# EAGLE schematic motherboard (EAGLE 5.10)
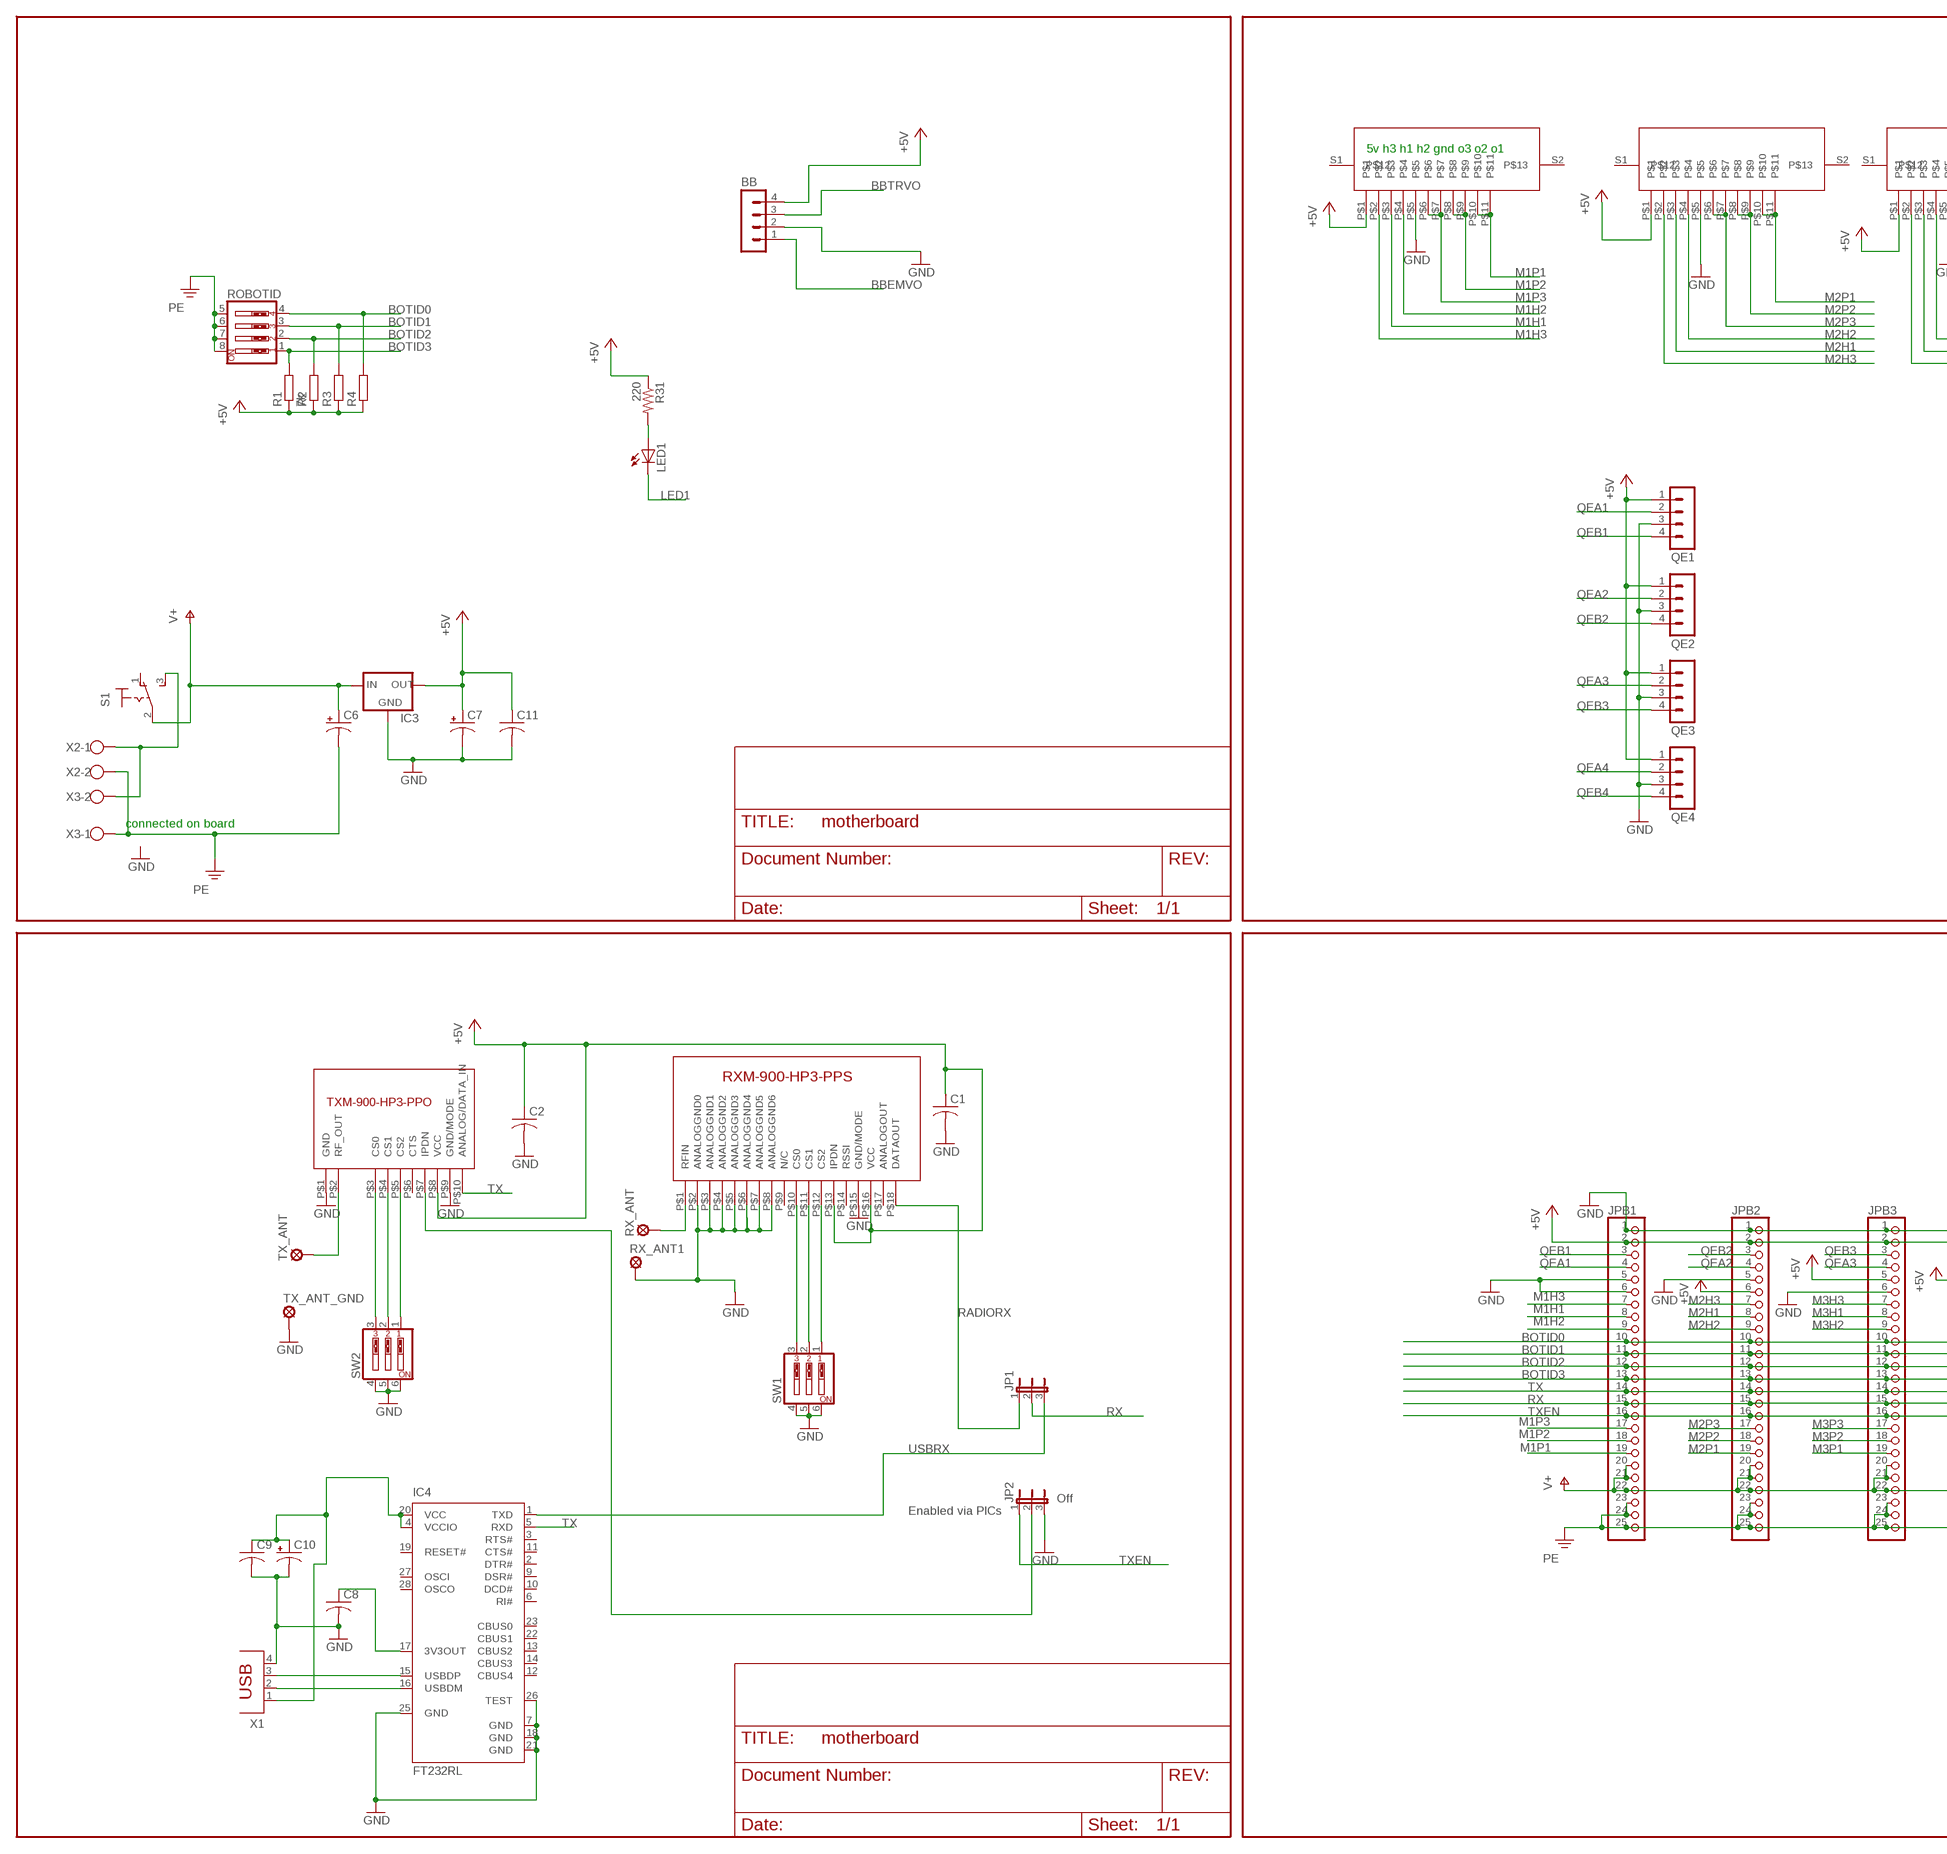
[diagram p0: schematic, sheet 1, part 1 of 2]
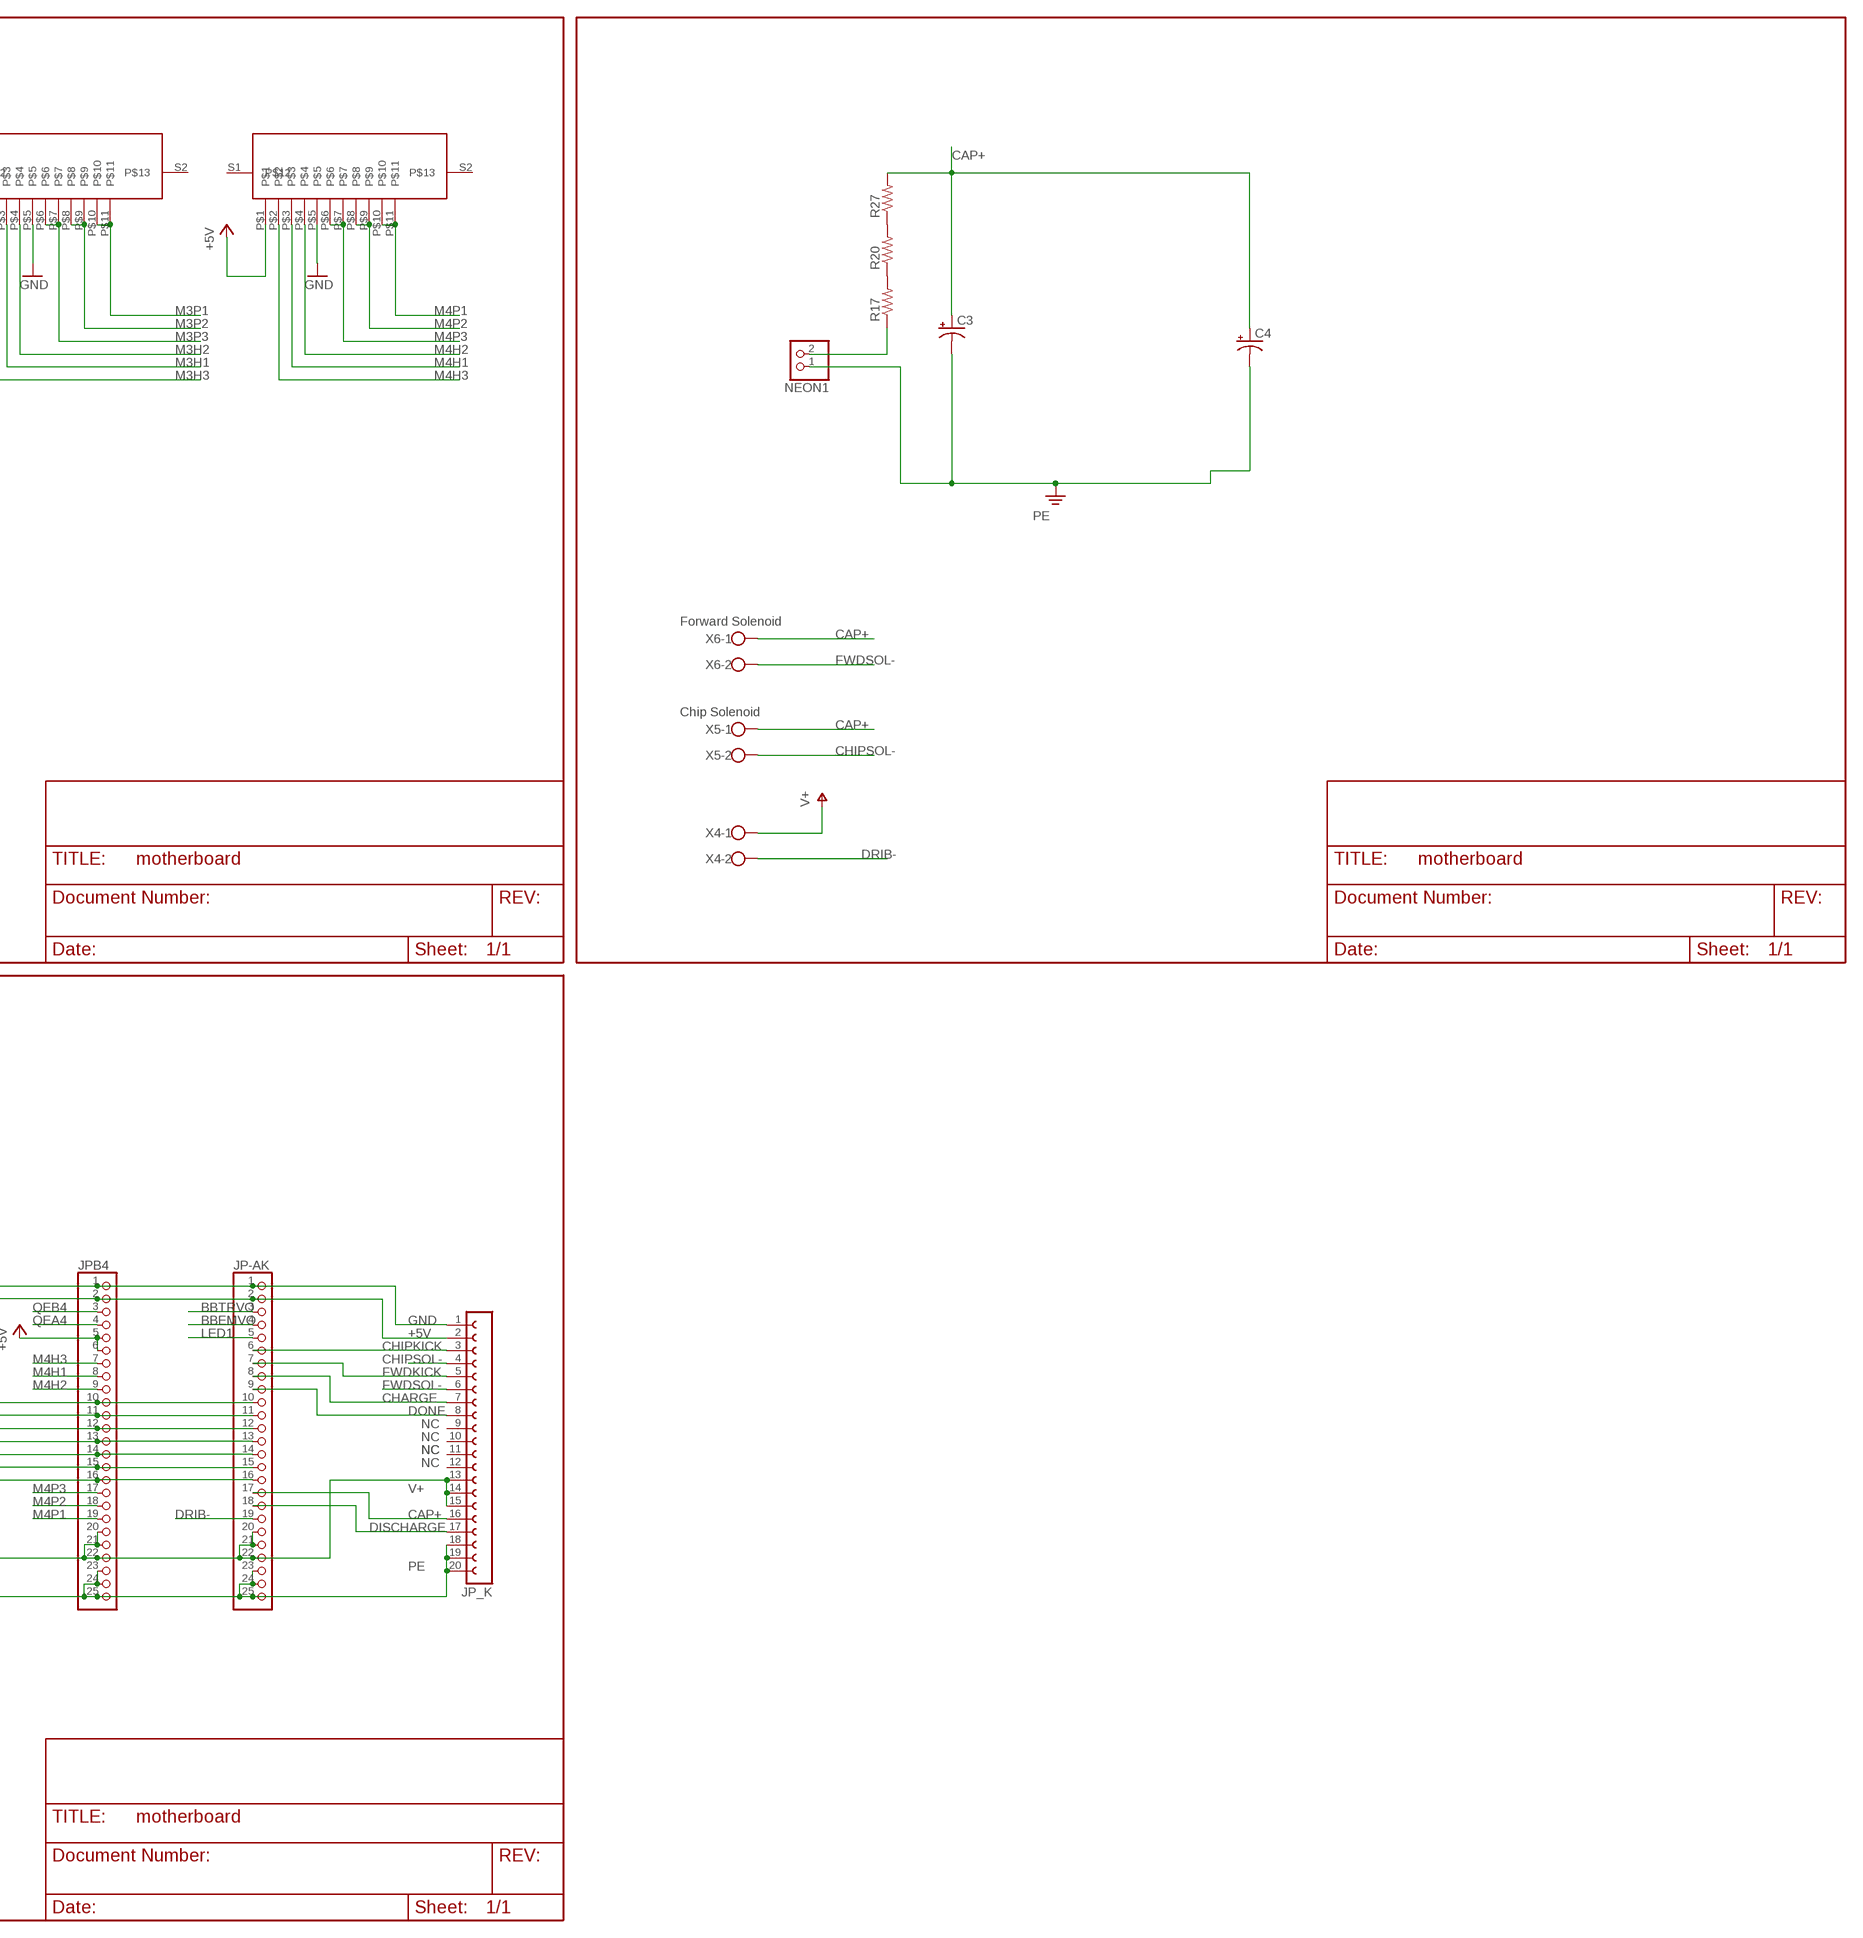
[diagram p1: schematic, sheet 1, part 2 of 2]

## Parts
BB  MA04-1  [MA04-1]
C1  C-USC0805  [C0805]
C2  C-USC0805  [C0805]
C3  CPOL-USE10-35  [EB35D]
C4  CPOL-USE10-35  [EB35D]
C6  CPOL-USE3.5-8  [E3,5-8]
C7  CPOL-USE3.5-8  [E3,5-8]
C8  C-USC0805  [C0805]
C9  C-USC0805  [C0805]
C10  CPOL-USE2.5-6  [E2,5-6]
C11  C-USC0805  [C0805]
IC3  78XXS  [78XXS]
IC4  FT232RL  [SSOP28]
JP1  JP2E  [JP2]
JP2  JP2E  [JP2]
JP-AK  PINHD-1X25  [1X25]
JP_K  FE20-1  [FE20]
JPB1  PINHD-1X25  [1X25]
JPB2  PINHD-1X25  [1X25]
JPB3  PINHD-1X25  [1X25]
JPB4  PINHD-1X25  [1X25]
LED1  LEDCHIPLED_0805  [CHIPLED_0805]
MOTOR1  MOTORCONNECT  [53261-11]
MOTOR2  MOTORCONNECT  [53261-11]
MOTOR3  MOTORCONNECT  [53261-11]
MOTOR4  MOTORCONNECT  [53261-11]
NEON1  PINHD-1X2  [1X02]
QE1  MA04-1  [MA04-1]
QE2  MA04-1  [MA04-1]
QE3  MA04-1  [MA04-1]
QE4  MA04-1  [MA04-1]
R1  7k  R-R0805  [R0805]
R2  R-R0805  [R0805]
R3  R-R0805  [R0805]
R4  R-R0805  [R0805]
R17  R-US_R0805  [R0805]
R20  R-US_R0805  [R0805]
R27  R-US_R0805  [R0805]
R31  220  R-US_R0805  [R0805]
ROBOTID  SW_DIP-4  [EDG-04]
RX_ANT  LSP13  [LSP13]
RX_ANT1  LSP13  [LSP13]
S1  M9040P  [M9040P]
SW1  SW_DIP-3  [EDG-03]
SW2  SW_DIP-3  [EDG-03]
TX_ANT  LSP13  [LSP13]
TX_ANT_GND  LSP13  [LSP13]
U$1  RXM-900-HP3-PPS  [SIP-18]
U$2  TXM-900-HP3-PPO  [SIP-10]
X1  PN61729  [PN61729]
X2  W237-102  [W237-102]
X3  W237-102  [W237-102]
X4  W237-102  [W237-102]
X5  W237-102  [W237-102]
X6  W237-102  [W237-102]

## Nets
+5V: BB.4 C1.1 C2.1 C7.+ C11.1 IC3.OUT JP-AK.2 JP_K.2 JPB1.2 JPB2.2 JPB2.6 JPB3.2 JPB3.5 JPB4.2 JPB4.5 JPB4.6 MOTOR1.P$1 MOTOR2.P$1 MOTOR3.P$1 MOTOR4.P$1 QE1.1 QE2.1 QE3.1 QE4.1 R1.1 R2.1 R3.1 R4.1 R31.1 U$1.P$13(IPDN) U$1.P$16(VCC) U$2.P$8(VCC)
BATT2+: S1.3(S) X2.1 X3.2
BBEMVO: BB.1 JP-AK.4
BBTRVO: BB.3 JP-AK.3
BOTID0: JP-AK.10 JPB1.10 JPB2.10 JPB3.10 JPB4.10 R4.2 ROBOTID.4
BOTID1: JP-AK.11 JPB1.11 JPB2.11 JPB3.11 JPB4.11 R3.2 ROBOTID.3
BOTID2: JP-AK.12 JPB1.12 JPB2.12 JPB3.12 JPB4.12 R2.2 ROBOTID.2
BOTID3: JP-AK.13 JPB1.13 JPB2.13 JPB3.13 JPB4.13 R1.2 ROBOTID.1
CAP+: C3.+ C4.+ JP-AK.17 JP_K.16 R27.2 X5.1 X6.1
CHARGE: JP-AK.8 JP_K.7
CHIPKICK: JP-AK.6 JP_K.3
CHIPSOL-: JP_K.4 X5.2
DISCHARGE: JP-AK.18 JP_K.17
DONE: JP-AK.9 JP_K.8
DRIB-: JP-AK.19 X4.2
FWDKICK: JP-AK.7 JP_K.5
FWDSOL-: JP_K.6 X6.2
GND: BB.2 C1.2 C2.2 C7.- C8.2 C9.2 C10.- C11.2 IC3.GND IC4.7(GND) IC4.18(GND) IC4.21(GND) IC4.25(GND) IC4.26(TEST) JP2.3 JP-AK.1 JP_K.1 JPB1.1 JPB1.5 JPB1.6 JPB2.1 JPB2.5 JPB3.1 JPB3.6 JPB4.1 MOTOR1.P$5 MOTOR2.P$5 MOTOR3.P$5 MOTOR4.P$5 QE1.3 QE2.3 QE3.3 QE4.3 RX_ANT1.MP SW1.4 SW1.5 SW1.6 SW2.4 SW2.5 SW2.6 TX_ANT_GND.MP U$1.P$2(ANALOGGND0) U$1.P$3(ANALOGGND1) U$1.P$4(ANALOGGND2) U$1.P$5(ANALOGGND3) U$1.P$6(ANALOGGND4) U$1.P$7(ANALOGGND5) U$1.P$8(ANALOGGND6) U$1.P$15(GND/MODE) U$2.P$1(GND) U$2.P$9(GND/MODE) X1.4
LED1: JP-AK.5 LED1.C
M1H1: JPB1.8 MOTOR1.P$3
M1H2: JPB1.9 MOTOR1.P$4
M1H3: JPB1.7 MOTOR1.P$2
M1P1: JPB1.19 MOTOR1.P$10 MOTOR1.P$11
M1P2: JPB1.18 MOTOR1.P$8 MOTOR1.P$9
M1P3: JPB1.17 MOTOR1.P$6 MOTOR1.P$7
M2H1: JPB2.8 MOTOR2.P$3
M2H2: JPB2.9 MOTOR2.P$4
M2H3: JPB2.7 MOTOR2.P$2
M2P1: JPB2.19 MOTOR2.P$10 MOTOR2.P$11
M2P2: JPB2.18 MOTOR2.P$8 MOTOR2.P$9
M2P3: JPB2.17 MOTOR2.P$6 MOTOR2.P$7
M3H1: JPB3.8 MOTOR3.P$3
M3H2: JPB3.9 MOTOR3.P$4
M3H3: JPB3.7 MOTOR3.P$2
M3P1: JPB3.19 MOTOR3.P$10 MOTOR3.P$11
M3P2: JPB3.18 MOTOR3.P$8 MOTOR3.P$9
M3P3: JPB3.17 MOTOR3.P$6 MOTOR3.P$7
M4H1: JPB4.8 MOTOR4.P$3
M4H2: JPB4.9 MOTOR4.P$4
M4H3: JPB4.7 MOTOR4.P$2
M4P1: JPB4.19 MOTOR4.P$10 MOTOR4.P$11
M4P2: JPB4.18 MOTOR4.P$8 MOTOR4.P$9
M4P3: JPB4.17 MOTOR4.P$6 MOTOR4.P$7
N$2: C9.1 C10.+ IC4.4(VCCIO) IC4.20(VCC) X1.1
N$3: LED1.A R31.2
N$13: RX_ANT.MP U$1.P$1(RFIN)
N$14: TX_ANT.MP U$2.P$2(RF_OUT)
N$16: JP2.2 U$2.P$7(IPDN)
N$17: C8.1 IC4.17(3V3OUT)
N$18: IC4.15(USBDP) X1.3
N$19: IC4.16(USBDM) X1.2
N$21: R17.2 R20.1
N$27: R20.2 R27.1
N$31: NEON1.2 R17.1
PE: C3.- C4.- C6.- JP-AK.23 JP-AK.24 JP-AK.25 JP_K.18 JP_K.19 JP_K.20 JPB1.23 JPB1.24 JPB1.25 JPB2.23 JPB2.24 JPB2.25 JPB3.23 JPB3.24 JPB3.25 JPB4.23 JPB4.24 JPB4.25 NEON1.1 ROBOTID.5 ROBOTID.6 ROBOTID.7 ROBOTID.8 X2.2 X3.1
QEA1: JPB1.4 QE1.2
QEA2: JPB2.4 QE2.2
QEA3: JPB3.4 QE3.2
QEA4: JPB4.4 QE4.2
QEB1: JPB1.3 QE1.4
QEB2: JPB2.3 QE2.4
QEB3: JPB3.3 QE3.4
QEB4: JPB4.3 QE4.4
RADIORX: JP1.1 U$1.P$18(DATAOUT)
RX: JP1.2 JP-AK.15 JPB1.15 JPB2.15 JPB3.15 JPB4.15
RXCS0: SW1.3 U$1.P$10(CS0)
RXCS1: SW1.2 U$1.P$11(CS1)
RXCS2: SW1.1 U$1.P$12(CS2)
TX: IC4.5(RXD) JP-AK.14 JPB1.14 JPB2.14 JPB3.14 JPB4.14 U$2.P$10(ANALOG/DATA_IN)
TXCS0: SW2.3 U$2.P$3(CS0)
TXCS1: SW2.2 U$2.P$4(CS1)
TXCS2: SW2.1 U$2.P$5(CS2)
TXEN: JP2.1 JP-AK.16 JPB1.16 JPB2.16 JPB3.16 JPB4.16
USBRX: IC4.1(TXD) JP1.3
V+: C6.+ IC3.IN JP-AK.20 JP-AK.21 JP-AK.22 JP_K.13 JP_K.14 JP_K.15 JPB1.20 JPB1.21 JPB1.22 JPB2.20 JPB2.21 JPB2.22 JPB3.20 JPB3.21 JPB3.22 JPB4.20 JPB4.21 JPB4.22 S1.2(P) X4.1
Unconnected: IC4.2(DTR#) IC4.3(RTS#) IC4.6(RI#) IC4.9(DSR#) IC4.10(DCD#) IC4.11(CTS#) IC4.12(CBUS4) IC4.13(CBUS2) IC4.14(CBUS3) IC4.19(RESET#) IC4.22(CBUS1) IC4.23(CBUS0) IC4.27(OSCI) IC4.28(OSCO) JP_K.9 JP_K.10 JP_K.11 JP_K.12 MOTOR1.S1 MOTOR1.S2 MOTOR2.S1 MOTOR2.S2 MOTOR3.S1 MOTOR3.S2 MOTOR4.S1 MOTOR4.S2 S1.1(O) U$1.P$9(N/C) U$1.P$14(RSSI) U$1.P$17(ANALOGOUT) U$2.P$6(CTS)

## Notes on the sheet
- 5v h3 h1 h2 gnd o3 o2 o1
- Forward Solenoid
- Chip Solenoid
- connected on board
- NC
- NC
- NC | NC
- NC
- Off
- Enabled via PICs

## Library data of the parts
BB QE1-QE4 = con-lstb:MA04-1: PIN HEADER
C1 C2 C8 C9 C11 = rcl:C-US: CAPACITOR, American symbol
C3 C4 C6 C7 C10 = rcl:CPOL-US: POLARIZED CAPACITOR, American symbol
IC3 = v-reg:78XXS: VOLTAGE REGULATOR
IC4 = ftdichip:FT232R: Source: http://www.ftdichip.com/Documents/DataSheets/DS_FT232R_v104.pdf
JP1 JP2 = jumper:JP2E: JUMPER
JP-AK JPB1-JPB4 = pinhead:PINHD-1X25: PIN HEADER
JP_K = con-lsta:FE20-1: FEMALE HEADER
LED1 = led:LED: LED OSRAM: - CHIPLED LG R971, LG N971, LY N971, LG Q971, LY Q971, LO R971, LY R971 LH N974, LH R974 LS Q976, LO Q976, LY Q976 LO Q996 - Hyper CHIPLED LW Q18S LB Q993, LB Q99A, LB R99A - SideLED LS A670, LO A670, LY A670, LG A670, LP A670 LB A673, LV A673, LT A673, LW A673 LH A674 LY A675 LS A676, LA A676, LO A676, LY A676, LW A676 LS A679, LY A679, LG A679 - Hyper Micro SIDELED® LS Y876, LA Y876, LO Y876, LY Y876 LT Y87S - SmartLED LW L88C, LW L88S LB L89C, LB L89S, LG L890 LS L89K, LO L89K, LY L89K LS L896, LA L896, LO L896, LY L896 - TOPLED LS T670, LO T670, LY T670, LG T670, LP T670 LSG T670, LSP T670, LSY T670, LOP T670, LYG T670 LG T671, LOG T671, LSG T671 LB T673, LV T673, LT T673, LW T673 LH T674 LS T676, LA T676, LO T676, LY T676, LB T676, LH T676, LSB T676, LW T676 LB T67C, LV T67C, LT T67C, LS T67K, LO T67K, LY T67K, LW E67C LS E67B, LA E67B, LO E67B, LY E67B, LB E67C, LV E67C, LT E67C LW T67C LS T679, LY T679, LG T679 LS T770, LO T770, LY T770, LG T770, LP T770 LB T773, LV T773, LT T773, LW T773 LH T774 LS E675, LA E675, LY E675, LS T675 LS T776, LA T776, LO T776, LY T776, LB T776 LHGB T686 LT T68C, LB T68C - Hyper Mini TOPLED® LB M676 - Mini TOPLED Santana® LG M470 LS M47K, LO M47K, LY M47K Source: http://www.osram.convergy.de - LUMILED® LXK2-PW12-R00, LXK2-PW12-S00, LXK2-PW14-U00, LXK2-PW14-V00 LXK2-PM12-R00, LXK2-PM12-S00, LXK2-PM14-U00 LXK2-PE12-Q00, LXK2-PE12-R00, LXK2-PE12-S00, LXK2-PE14-T00, LXK2-PE14-U00 LXK2-PB12-K00, LXK2-PB12-L00, LXK2-PB12-M00, LXK2-PB14-N00, LXK2-PB14-P00, LXK2-PB14-Q00 LXK2-PR12-L00, LXK2-PR12-M00, LXK2-PR14-Q00, LXK2-PR14-R00 LXK2-PD12-Q00, LXK2-PD12-R00, LXK2-PD12-S00 LXK2-PH12-R00, LXK2-PH12-S00 LXK2-PL12-P00, LXK2-PL12-Q00, LXK2-PL12-R00 Source: www.luxeon.com
MOTOR1-MOTOR4 = brushless:MOTORCONNECT
NEON1 = pinhead:PINHD-1X2: PIN HEADER
R1-R4 = quantum-sensor:R: Resistor
R17 R20 R27 R31 = rcl:R-US_: RESISTOR, American symbol
ROBOTID = special:SW_DIP-4: DIP SWITCH
RX_ANT RX_ANT1 TX_ANT TX_ANT_GND = solpad:LSP13: SOLDER PAD drill 1.3 mm, distributor Buerklin, 12H562
S1 = switch:M9040P: TOGGLE SWITCH Marquardt
SW1 SW2 = special:SW_DIP-3: DIP SWITCH
U$1 = rfc:RXM-900-HP3-PPS
U$2 = rfc:TXM-900-HP3-PPO
X1 = con-berg:PN61729: BERG USB connector
X2-X6 = con-wago-500:W237-102: WAGO SCREW CLAMP

## Net classes
1 supply: width 0.508 mm
2 motor: width 0.508 mm